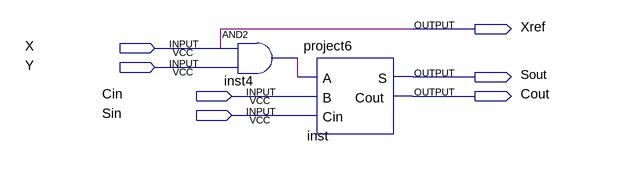
[diagram p0: schematic sheet]
// Quartus schematic multiplication_unit.bdf as structural Verilog: 2 symbols, 7 pins
module multiplication_unit (
  input  X,
  input  Y,
  input  Cin,
  input  Sin,
  output Xref,
  output Sout,
  output Cout
);

  wire inst4_out;

  and inst4 (inst4_out, X, Y);
  project6 inst (.A(inst4_out), .B(Cin), .Cin(Sin), .S(Sout), .Cout(Cout));

  assign Xref = X;
endmodule
